# EAGLE design band-dsp-feather (EAGLE 8.2.1)
DATABASE: /Users/ingolia/Dropbox/Experiments/turbidostat/nephelometer/circuitry/partsdb.txt
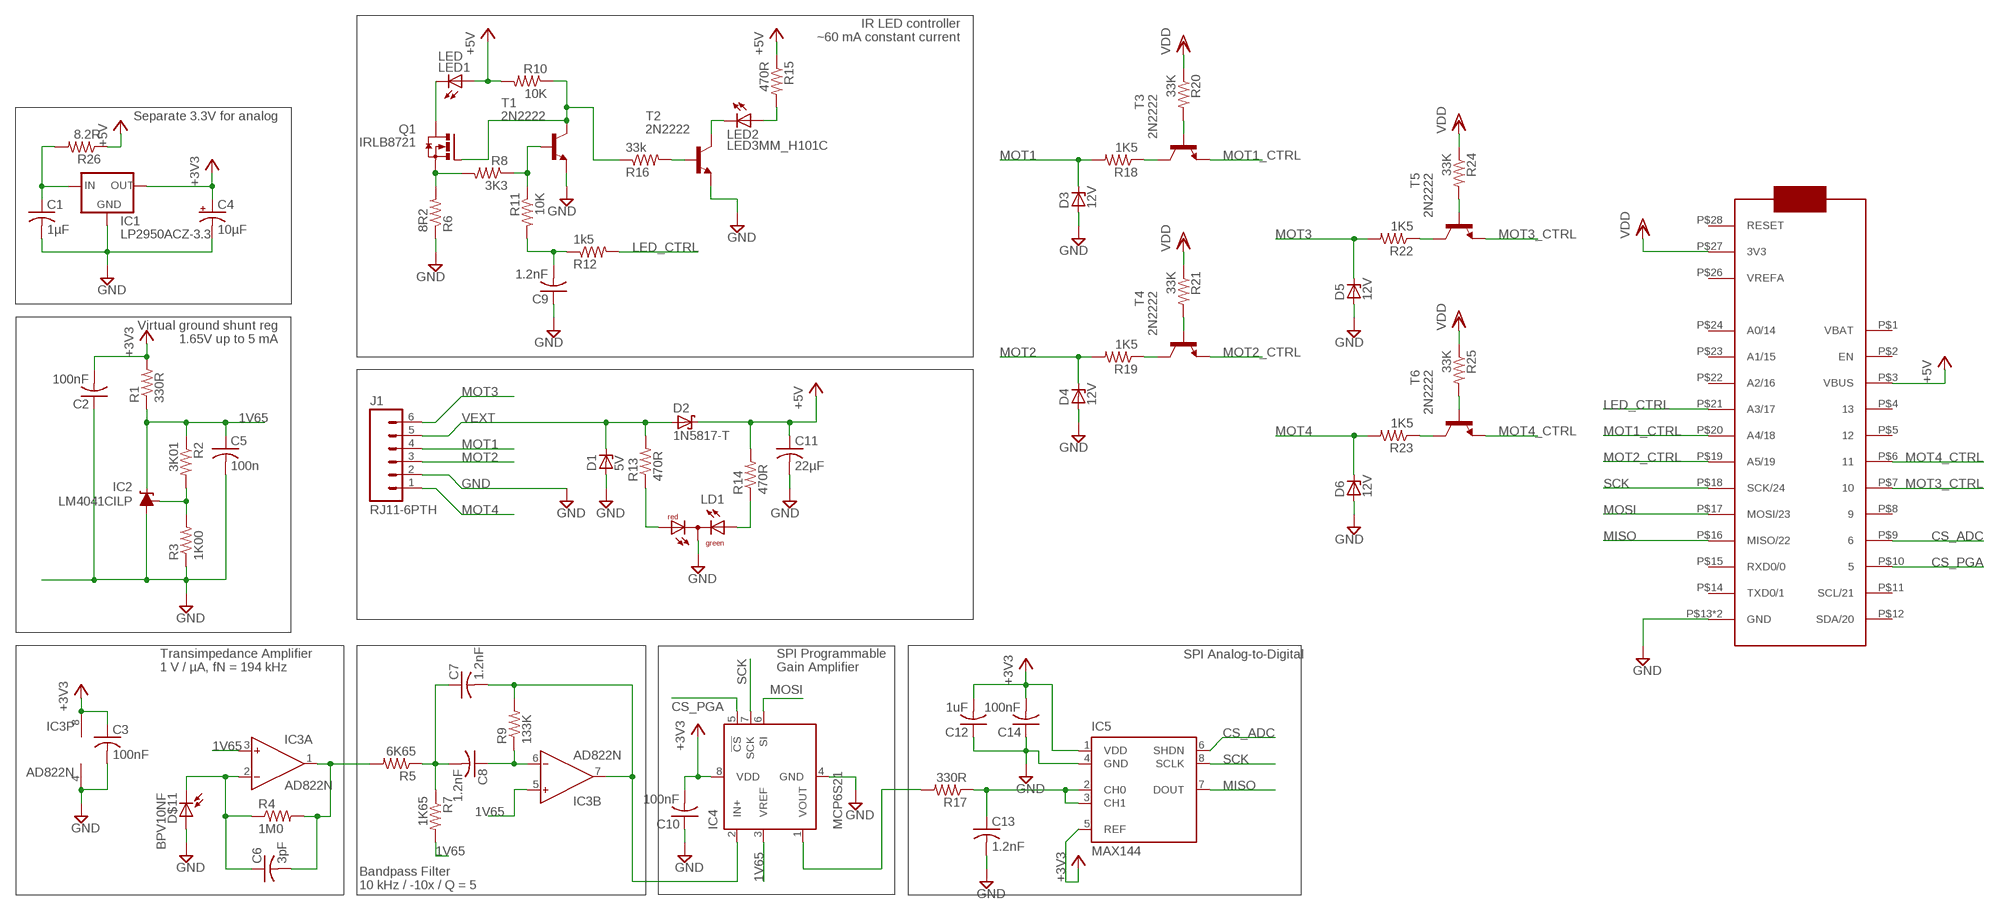
[diagram p0: schematic, sheet 1]

## Parts
C1  1µF  C-US025-030X050  [C025-030X050]
C2  100nF  C-US025-025X050  [C025-025X050]
C3  100nF  C-US025-025X050  [C025-025X050]
C4  10µF  CPOL-USE2.5-5  [E2,5-5]
C5  100n  C-US025-025X050  [C025-025X050]
C6  3pF  C-US025-024X044  [C025-024X044]
C7  1.2nF  C-US025-025X050  [C025-025X050]
C8  1.2nF  C-US025-025X050  [C025-025X050]
C9  1.2nF  C-US025-025X050  [C025-025X050]
C10  100nF  C-US025-025X050  [C025-025X050]
C11  22µF  C-US050-045X075  [C050-045X075]
C12  1uF  C-US025-025X050  [C025-025X050]
C13  1.2nF  C-US025-025X050  [C025-025X050]
C14  100nF  C-US025-025X050  [C025-025X050]
D1  5V  ZENER-DIODEF126-10  [F126Z10]
D2  1N5817-T  [DO41-7.6]
D3  12V  ZENER-DIODEF126-10  [F126Z10]
D4  12V  ZENER-DIODEF126-10  [F126Z10]
D5  12V  ZENER-DIODEF126-10  [F126Z10]
D6  12V  ZENER-DIODEF126-10  [F126Z10]
D$11  BPV10NF  [LED5MM]
IC1  LP2950ACZ-3.3  [TO92]
IC2  LM4041CILP  [LP_O-PBCY-W3]
IC3  AD822N  [DIL08]
IC4  MCP6S21  [DIL08]
IC5  MAX144  [DIL08]
IC6  FEATHER_M0  [FEATHER_M0]
J1  RJ11-6PTH  [RJ11-6]
LD1  DUOLED-RG-C  [DUOLED-C-5MM]
LED1  LED  1X02_3.5MM_LED  [1X02_3.5MM]
LED2  LED3MM_H101C  [LED3MM_H101C]
Q1  IRLB8721  [TO220BV]
R1  330R  R-US_0207/9  [0207/9]
R2  3K01  R-US_0207/9  [0207/9]
R3  1K00  R-US_0207/9  [0207/9]
R4  1M0  R-US_0207/9  [0207/9]
R5  6K65  R-US_0207/9  [0207/9]
R6  8R2  R-US_0207/9  [0207/9]
R7  1K65  R-US_0207/9  [0207/9]
R8  3K3  R-US_0207/9  [0207/9]
R9  133K  R-US_0207/9  [0207/9]
R10  10K  R-US_0207/9  [0207/9]
R11  10K  R-US_0207/9  [0207/9]
R12  1k5  R-US_0207/9  [0207/9]
R13  470R  R-US_0207/9  [0207/9]
R14  470R  R-US_0207/9  [0207/9]
R15  470R  R-US_0207/5V  [0207/5V]
R16  33k  R-US_0207/9  [0207/9]
R17  330R  R-US_0207/9  [0207/9]
R18  1K5  R-US_0207/9  [0207/9]
R19  1K5  R-US_0207/9  [0207/9]
R20  33K  R-US_0207/9  [0207/9]
R21  33K  R-US_0207/9  [0207/9]
R22  1K5  R-US_0207/9  [0207/9]
R23  1K5  R-US_0207/9  [0207/9]
R24  33K  R-US_0207/9  [0207/9]
R25  33K  R-US_0207/9  [0207/9]
R26  8.2R  R-US_0207/9  [0207/9]
T1  2N2222  [TO92-EBC-OVAL]
T2  2N2222  [TO92-EBC-OVAL]
T3  2N2222  [TO92-EBC-OVAL]
T4  2N2222  [TO92-EBC-OVAL]
T5  2N2222  [TO92-EBC-OVAL]
T6  2N2222  [TO92-EBC-OVAL]

## Nets
1V65: C5.1 IC2.2(C) IC3.3(A:IN+) IC3.5(B:IN+) IC4.3(VREF) R1.1 R2.1 R7.2
+3V3: C2.2 C3.1 C4.+ C10.2 C12.2 C14.2 IC1.1(OUT) IC3.8(P:V+) IC4.8(VDD) IC5.1(VDD) IC5.5(REF) R1.2
+5V: C11.1 D2.C IC6.P$3(VBUS) LED1.1A(A) R10.2 R14.2 R15.1 R26.1
BPF: C7.2 IC3.7(B:OUT) IC4.2(IN+) R9.2
CS_ADC: IC5.6(SHDN) IC6.P$9
CS_PGA: IC4.5(!CS) IC6.P$10
FB: C6.1 D$11.K IC3.2(A:IN-) R4.1
GND: C1.2 C2.1 C3.2 C4.- C5.2 C9.1 C10.1 C11.2 C12.1 C13.2 C14.1 D1.A D3.A D4.A D5.A D6.A D$11.A IC1.2(GND) IC2.3(A) IC3.4(P:V-) IC4.4(GND) IC5.4(GND) IC6.P$13(GND) IC6.P$25(GND) J1.2 LD1.C R3.1 R6.1 T1.E T2.E
LED_CTRL: IC6.P$21(A3/17) R12.2
MISO: IC5.7(DOUT) IC6.P$16(MISO/22)
MOSI: IC4.6(SI) IC6.P$17(MOSI/23)
MOT1: D3.C J1.4 R18.2
MOT1_CTRL: IC6.P$20(A4/18) T3.E
MOT2: D4.C J1.3 R19.2
MOT2_CTRL: IC6.P$19(A5/19) T4.E
MOT3: D5.C J1.6 R22.2
MOT3_CTRL: IC6.P$7 T5.E
MOT4: D6.C J1.1 R23.2
MOT4_CTRL: IC6.P$6 T6.E
N$1: R19.1 T4.C
N$2: R21.2 T4.B
N$3: C7.1 C8.2 R5.1 R7.1
N$4: IC4.1(VOUT) R17.2
N$5: R22.1 T5.C
N$6: R24.2 T5.B
N$7: LD1.AX(AG) R14.1
N$8: Q1.G R10.1 R16.1 T1.C
N$9: C8.1 IC3.6(B:IN-) R9.1
N$10: R23.1 T6.C
N$11: LED2.A R15.2
N$12: LED2.K T2.C
N$13: R8.1 R11.1 T1.B
N$14: Q1.S R6.2 R8.2
N$15: C9.2 R11.2 R12.1
N$16: R16.2 T2.B
N$18: LED1.2K(K) Q1.D
N$19: R18.1 T3.C
N$20: R20.2 T3.B
N$21: R25.2 T6.B
N$22: LD1.AR R13.1
N$23: C13.1 IC5.2(CH0) IC5.3(CH1) R17.1
N$24: C1.1 IC1.3(IN) R26.2
N$35: IC2.1(FB) R2.2 R3.2
SCK: IC4.7(SCK) IC5.8(SCLK) IC6.P$18(SCK/24)
TIA: C6.2 IC3.1(A:OUT) R4.2 R5.2
VDD: IC6.P$27(3V3) R20.1 R21.1 R24.1 R25.1
VEXT: D1.C D2.A J1.5 R13.2
Unconnected: IC6.P$1(VBAT) IC6.P$2(EN) IC6.P$4 IC6.P$5 IC6.P$8 IC6.P$11(SCL/21) IC6.P$12(SDA/20) IC6.P$14(TXD0/1) IC6.P$15(RXD0/0) IC6.P$22(A2/16) IC6.P$23(A1/15) IC6.P$24(A0/14) IC6.P$26(VREFA) IC6.P$28(RESET)

## Notes on the sheet
- IR LED controller
  ~60 mA constant current
- Separate 3.3V for analog
- Virtual ground shunt reg
  1.65V up to 5 mA
- SPI Analog-to-Digital
- Transimpedance Amplifier
  1 V / µA, fN = 194 kHz
- SPI Programmable
  Gain Amplifier
- Bandpass Filter
  10 kHz / -10x / Q = 5

## Library data of the parts
C1 C12 = adafruit:C-US: CAPACITOR, American symbol; DIGIKEY#: 445-5318-ND; MANF: TDK Corporation; MANF#: FK14X7R1C105K
C2 C3 C5 C10 C14 = adafruit:C-US: CAPACITOR, American symbol; DIGIKEY#: BC1084CT-ND; MANF: Vishay BC Components; MANF#: K104K15X7RF5TL2
C4 = adafruit:CPOL-US: POLARIZED CAPACITOR, American symbol; DIGIKEY#: 478-8042-1-ND; MANF: AVX Corporation; MANF#: TAP106K016SRW
C6 = adafruit:C-US: CAPACITOR, American symbol; DIGIKEY#: 445-8377-ND; MANF: TDK Corporation; MANF#: FK18C0G1H030C
C7-C9 C13 = adafruit:C-US: CAPACITOR, American symbol; DIGIKEY#: BC1026CT-ND; MANF: Vishay BC Components; MANF#: K122J15C0GF5TL2
C11 = adafruit:C-US: CAPACITOR, American symbol; DIGIKEY#: 445-8455-ND; MANF: TDK Corporation; MANF#: FK20X7R1C226M
D1 = diode:ZENER-DIODE: Z-Diode; DIGIKEY#: SA5.0ALFCT-ND; MANF: Littelfuse Inc.; MANF#: SA5.0A
D2 = diode:1N581*: 1.0A SCHOTTKY BARRIER RECTIFIER Source: http://www.diodes.com/datasheets/ds23001.pdf; DIGIKEY#: 1N5817FSCT-ND; MANF: Fairchild Semiconductor; MANF#: 1N5817
D3-D6 = diode:ZENER-DIODE: Z-Diode; DIGIKEY#: SA12ALFCT-ND; MANF: Littelfuse Inc.; MANF#: SA12A
D$11 = ingolia:BPV10NF; DIGIKEY#: 751-1002-ND; MANF: Vishay Semiconductor Opto Division; MANF#: BPV10NF
IC1 = v-reg:LP2950?*: Source: http://cache.national.com/ds/LP/LP2950.pdf; DIGIKEY#: LP2950ACZ-3.3/NOPB-ND; MANF: Texas Instruments; MANF#: LP2950ACZ-3.3/NOPB
IC2 = texas:LM4041*I: PRECISION MICROPOWER SHUNT VOLTAGE REFERENCE Adjustable Output Source: http://focus.ti.com/lit/ds/slcs146e/slcs146e.pdf; DIGIKEY#: 296-22173-1-ND; MANF: Texas Instruments; MANF#: LM4041CILPR; MPN: LM4041CILP; OC_FARNELL: 1673945; OC_NEWARK: 50M8856
IC3 = analog-devices:AD822: Single-Supply, Rail-to-Rail Low Power FET-Input Op Amp Source: http://www.analog.com/static/imported-files/data_sheets/AD822.pdf; DIGIKEY#: AD823ANZ-ND; MANF: Analog Devices Inc.; MANF#: AD823ANZ; OC_FARNELL: 1438581; OC_NEWARK: unknown
IC4 = ingolia:MCP6S21; DIGIKEY#: MCP6S91-E/P-ND; MANF: Microchip Technology; MANF#: MCP6S91-E/P
IC5 = ingolia:MAX144; DIGIKEY#: MAX144ACPA+-ND; MANF: Maxim Integrated; MANF#: MAX144ACPA+
IC6 = ingolia:FEATHER_M0; DIGIKEY#: 1528-1531-ND; DIGIKEY2#: 2830-ND; MANF: Adafruit Industries LLC; MANF#: 2772; MANF2: Adafruit Industries LLC; MANF2#: 2830
J1 = SparkFun-Connectors:RJ11-6: RJ11 Jack Simple 6 pin RJ11 jack. Commonly found on CAT3 devices and Microchip programmers. SKU: PRT-00132; DIGIKEY#: AE10383-ND; MANF: Assmann WSW Components; MANF#: A-2004-1-4-LP-N-R
LD1 = led:DUOLED-RG-C: DUO LED 2 colors (red/green), 5 mm, round, common Cathode www.ligitek.com or other producers.; DIGIKEY#: 754-1221-ND; MANF: Kingbright; MANF#: WP3VEGW
LED1 = ingolia:1X02_3.5MM_LED; DIGIKEY#: 475-3002-ND; DIGIKEY2#: 492-1502-ND; DIGIKEY3#: ED2740-ND; MANF: OSRAM Opto Semiconductors Inc; MANF#: SFH 4547; MANF2: Bivar Inc; MANF2#: CR-174; MANF3: On Shore Technology Inc.; MANF3#: OSTTE020104
LED2 = ingolia:LED3MM_H101C; DIGIKEY#: 754-1727-ND; DIGIKEY2#: 492-1789-ND; MANF: Kingbright; MANF#: WP710A10SYD; MANF2: Bivar Inc.; MANF2#: H-101C
Q1 = ingolia:IRLB8721; DIGIKEY#: IRLB8721PBF-ND; MANF: Infineon Technologies; MANF#: IRLB8721PBF
R1 = adafruit:R-US_: RESISTOR, American symbol; DIGIKEY#: CF14JT330RCT-ND; MANF: Stackpole Electronics Inc.; MANF#: CF14JT330R
R2 = adafruit:R-US_: RESISTOR, American symbol; DIGIKEY#: RNF14FTD3K01CT-ND; MANF: Stackpole Electronics Inc.; MANF#: RNF14FTD3K01
R3 = adafruit:R-US_: RESISTOR, American symbol; DIGIKEY#: RNF14FTD1K00CT-ND; MANF: Stackpole Electronics Inc.; MANF#: RNF14FTD1K00
R4 = adafruit:R-US_: RESISTOR, American symbol; DIGIKEY#: RNV14FAL1M00CT-ND; MANF: Stackpole Electronics Inc; MANF#: RNV14FAL1M00
R5 = adafruit:R-US_: RESISTOR, American symbol; DIGIKEY#: 6.65KXBK-ND; MANF: Yageo; MANF#: MFR-25FBF52-6K65
R6 R26 = adafruit:R-US_: RESISTOR, American symbol; DIGIKEY#: S8.2HCT-ND; MANF: Stackpole Electronics Inc.; MANF#: CFM12JT8R20
R7 = adafruit:R-US_: RESISTOR, American symbol; DIGIKEY#: 1.65KXBK-ND; MANF: Yageo; MANF#: MFR-25FBF52-1K65
R8 = adafruit:R-US_: RESISTOR, American symbol; DIGIKEY#: CF14JT3K30CT-ND; MANF: Stackpole Electronics Inc; MANF#: CF14JT3K30
R9 = adafruit:R-US_: RESISTOR, American symbol; DIGIKEY#: 133KXBK-ND; MANF: Yageo; MANF#: MFR-25FBF52-133K
R10 R11 = adafruit:R-US_: RESISTOR, American symbol; DIGIKEY#: CF14JT10K0CT-ND; MANF: Stackpole Electronics Inc; MANF#: CF14JT10K0
R12 = adafruit:R-US_: RESISTOR, American symbol; DIGIKEY#: CF14JT1K50CT-ND; MANF: Stackpole Electronics Inc; MANF#: CF14JT1K50
R13-R15 = adafruit:R-US_: RESISTOR, American symbol; DIGIKEY#: CF14JT470RCT-ND; MANF: Stackpole Electronics Inc.; MANF#: CF14JT470R
R16 = adafruit:R-US_: RESISTOR, American symbol; DIGIKEY#: CF14JT33K0CT-ND; MANF: Stackpole Electronics Inc; MANF#: CF14JT33K0
R17 = adafruit:R-US_: RESISTOR, American symbol; DIGIKEY#: S330CACT-ND; MANF: Stackpole Electronics Inc.; MANF#: RNMF14FTC330R
R18 R19 R22 R23 = adafruit:R-US_: RESISTOR, American symbol; DIGIKEY#: CF14JT1K50CT-ND; MANF: Stackpole Electronics Inc.; MANF#: CF14JT1K50
R20 R21 R24 R25 = adafruit:R-US_: RESISTOR, American symbol; DIGIKEY#: CF14JT33K0CT-ND; MANF: Stackpole Electronics Inc.; MANF#: CF14JT33K0
T1-T6 = adafruit:2N2222: NPN TRANSISTOR Big oval pads; DIGIKEY#: PN2222ATFCT-ND; MANF: Fairchild Semiconductor; MANF#: PN2222ATF

## Board
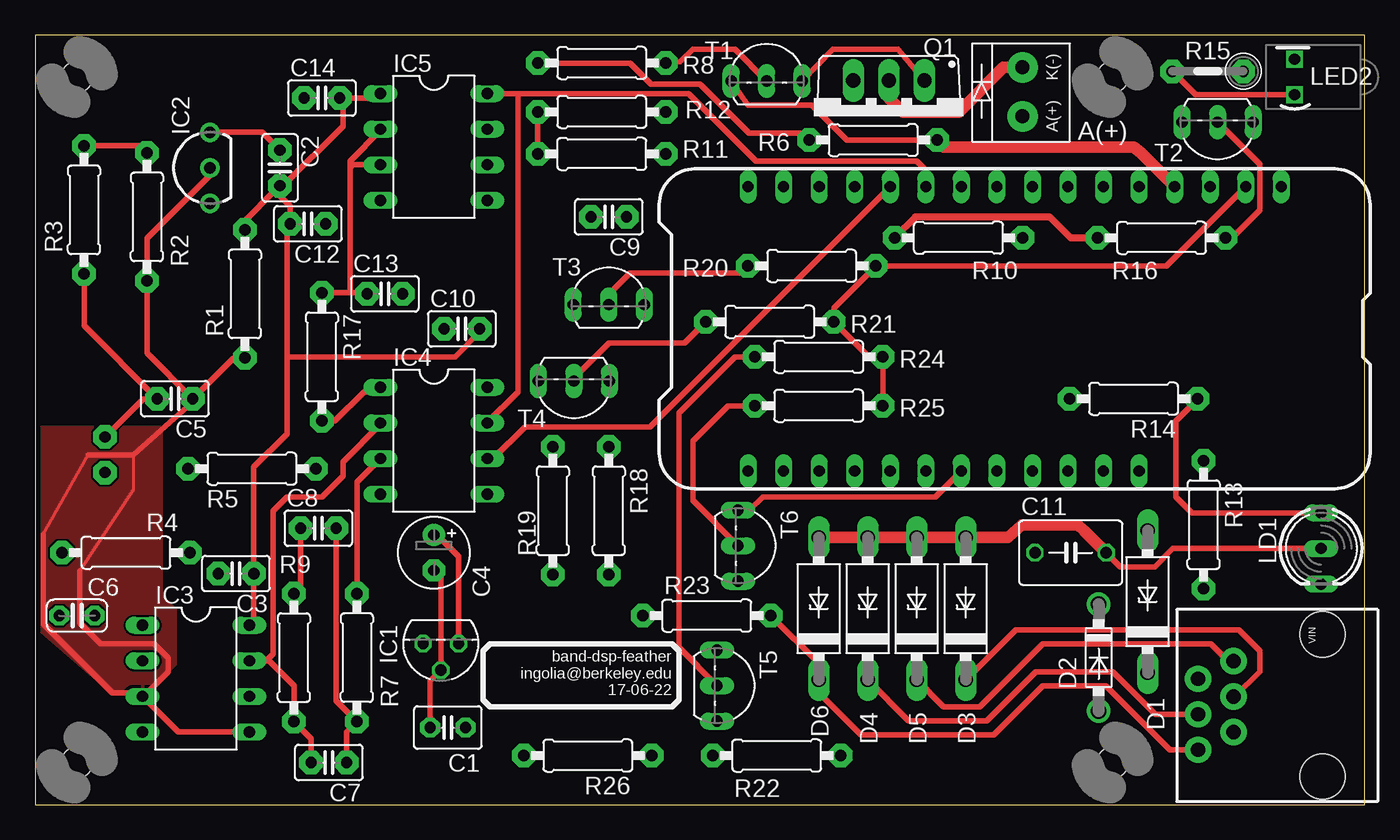
[diagram p1: board, top side]
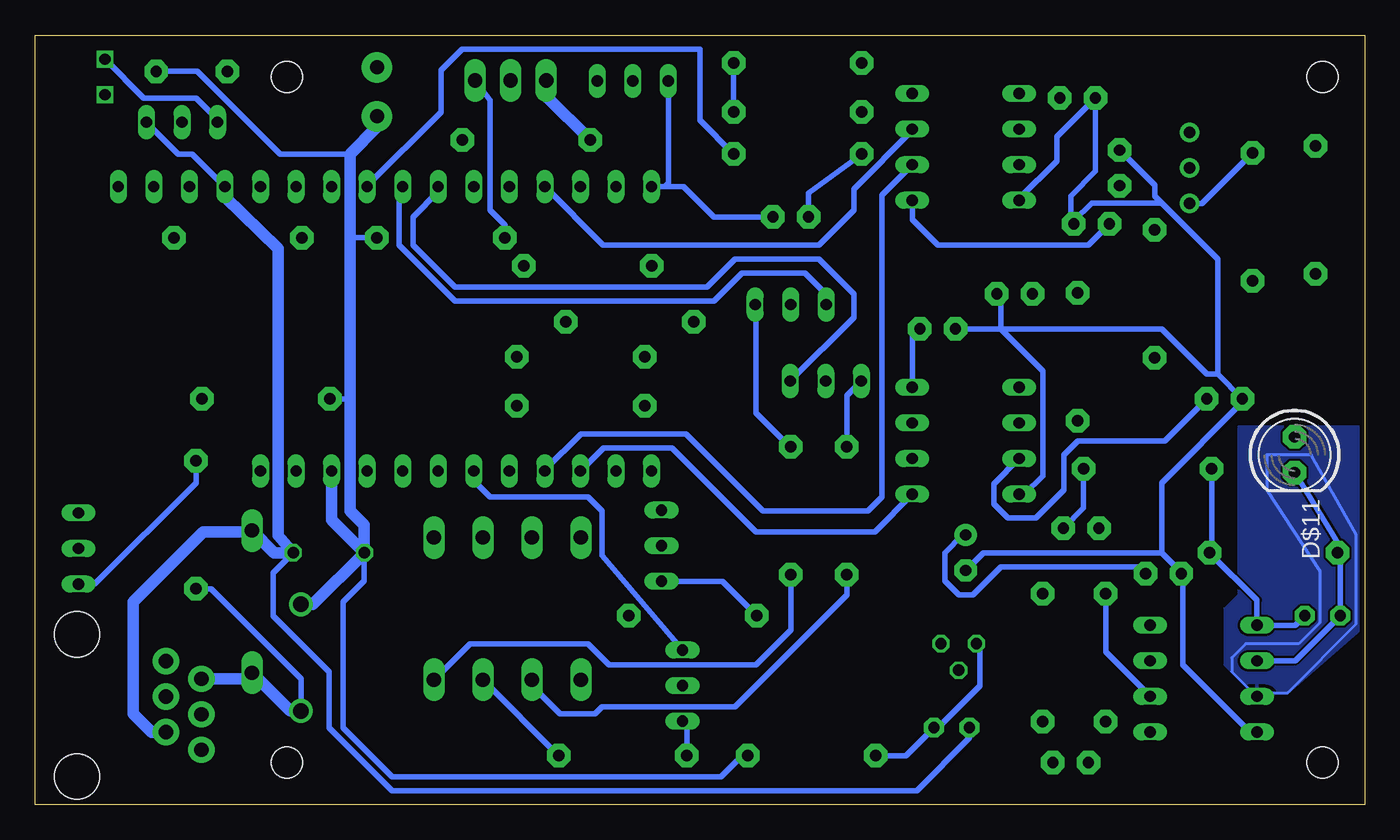
[diagram p2: board, bottom side, seen from below]

Size 95 x 55 mm. Coordinates in mm from the lower left corner, seen from the top.
Outline: 0,0 95,0 95,55 0,55 0,0
Copper layers (1*16): Top 0.0356mm / dielectric 1.5011mm / Bottom 0.0356mm
Design rules "oshpark-2layer": minimum track width 6mil, minimum drill 13mil, track to track 6mil, track to pad 6mil, pad to pad 6mil, via to via 6mil, smd to smd 6mil, copper to edge 15mil, drill to drill 6mil, minimum pad ring 7mil, minimum via ring 7mil, stop-mask expansion 2.5mil, vias tented up to drill 0mil, thermal gap 10mil

### Footprints (pad centres in the part's own frame; a part is rotated, then mirrored left to right if it is on the bottom)
C025-030X050 = drill 0.813 pad 1.422 octagon: 1 -1.27,0; 2 1.27,0
C025-025X050 = drill 0.813 pad 1.676 octagon: 1 -1.27,0; 2 1.27,0
E2,5-5 = drill 0.813 pad 1.6: + -1.27,0 | drill 0.813 pad 1.6 octagon: - 1.27,0
C025-024X044 = drill 0.813 pad 1.422 octagon: 1 -1.27,0; 2 1.27,0
C050-045X075 = drill 0.813 octagon: 1 -2.54,0; 2 2.54,0
F126Z10 = drill 1.016 long: A 5.08,0; C -5.08,0
DO41-7.6 = drill 1.1 pad 1.7: A 3.81,0; C -3.81,0
LED5MM = drill 0.813 pad 1.676 octagon: A -1.27,0; K 1.27,0
TO92 = drill 0.813 octagon: 1 -1.27,0; 2 0,1.905; 3 1.27,0
LP_O-PBCY-W3 = drill 0.8 pad 1.4: 1 -2.54,0; 2 0,0; 3 2.54,0
DIL08 = drill 0.813 long: 1 -3.81,-3.81; 2 -1.27,-3.81; 3 1.27,-3.81; 4 3.81,-3.81; 5 3.81,3.81; 6 1.27,3.81; 7 -1.27,3.81; 8 -3.81,3.81
FEATHER_M0 = drill 0.8 long: P$1 -8.89,10.16; P$2 -6.35,10.16; P$3 -3.81,10.16; P$4 -1.27,10.16; P$5 1.27,10.16; P$6 3.81,10.16; P$7 6.35,10.16; P$8 8.89,10.16; P$9 11.43,10.16; P$10 13.97,10.16; P$11 16.51,10.16; P$12 19.05,10.16; P$13 19.05,-10.16; P$14 16.51,-10.16; P$15 13.97,-10.16; P$16 11.43,-10.16; P$17 8.89,-10.16; P$18 6.35,-10.16; P$19 3.81,-10.16; P$20 1.27,-10.16; P$21 -1.27,-10.16; P$22 -3.81,-10.16; P$23 -6.35,-10.16; P$24 -8.89,-10.16; P$25 -11.43,-10.16; P$26 -13.97,-10.16; P$27 -16.51,-10.16; P$28 -19.05,-10.16
RJ11-6 = drill 1.016 pad 1.88: 1 1.905,8.89; 2 3.175,6.35; 3 4.445,8.89; 4 5.715,6.35; 5 6.985,8.89; 6 8.255,6.35 | hole 3.251: 0,0; 10.16,0
DUOLED-C-5MM = drill 0.813 long: AR 2.54,0; AX -2.54,0; C 0,0
1X02_3.5MM = drill 1 pad 2.184: 1A 1.8,0; 2K -1.7,0
LED3MM_H101C = drill 0.8 square: A 1.27,0; K -1.27,0
TO220BV = drill 1.016 long: D 0,0; G -2.54,0; S 2.54,0
0207/9 = drill 0.813 pad 1.676 octagon: 1 -4.572,0; 2 4.572,0
0207/5V = drill 0.813 pad 1.676 octagon: 1 -2.54,0; 2 2.54,0
TO92-EBC-OVAL = drill 0.813 long: B 0,-1.27; C 2.54,-1.27; E -2.54,-1.27
M2MOUNT = hole 2.2: 0,0

### Placement (x,y rotation side)
C1  29.5,5.5 180 top
C2  17.5,45.5 270 top
C3  14.36,16.51 180 top
C4  28.5,18 270 top
C5  10,29 180 top
C6  3,13.5 0 top
C7  21,3 180 top
C8  20.25,19.75 0 top
C9  41,42 180 top
C10  30.5,34 0 top
C11  74,18 0 top
C12  19.5,41.5 180 top
C13  25,36.5 0 top
C14  20.5,50.5 0 top
D1  79.5,14.5 90 top
D2  76,10.5 270 top
D3  66.5,14 90 top
D4  59.5,14 90 top
D5  63,14 90 top
D6  56,14 90 top
D$11  5,25 270 bottom
IC1  29,11.5 180 top
IC2  12.5,45.5 90 top
IC3  11.5,9 270 top
IC4  28.5,26 270 top
IC5  28.5,47 270 top
IC6  70,34 180 top
J1  92,2 90 top
LD1  91.9,18.3 270 top
LED1  70.56,50.98 270 top
LED2  90,52 270 top
Q1  61.01,51.75 180 top
R1  15,36.5 90 top
R2  8,42 90 top
R3  3.5,42.5 90 top
R4  6.5,18 0 top
R5  15.5,24 180 top
R6  59.89,47.49 180 top
R7  23,10.5 90 top
R8  40.5,53 180 top
R9  18.5,10.5 270 top
R10  65.99,40.51 0 top
R11  40.5,49.5 180 top
R12  40.5,46.5 0 top
R13  83.5,20 270 top
R14  78.5,29 180 top
R15  83.8,52.4 180 top
R16  80.5,40.5 0 top
R17  20.5,32 270 top
R18  41,21 270 top
R19  37,21 270 top
R20  55.5,38.5 180 top
R21  52.5,34.5 180 top
R22  53,3.5 0 top
R23  48,13.5 0 top
R24  56,32 180 top
R25  56,28.5 180 top
R26  39.5,3.5 180 top
T1  52.28,52.98 0 top
T2  84.5,47.5 180 top
T3  41,37 0 top
T4  38.5,29 180 top
T5  50,8.5 270 top
T6  51.5,18.5 270 top
U$1  [M2MOUNT]  3,3 0 top
U$2  [M2MOUNT]  77,52 0 top
U$3  [M2MOUNT]  77,3 0 top
U$4  [M2MOUNT]  3,52 0 top

### Tracks (layer width: path | path; a pad name or v marks a point on that pad's centre or on a via)
1V65
  Top 0.203: 0.6,19.3 3.8,25 | 7,25 7,22.5 3.2,16.7
  Top 0.406: 3.8,25 7,25 11.27,28.77 C5.1 | 3.2,16.7 3.2,13 4.7,11.5 8.5,11.5 9.5,10.5 9.5,9.5 8,8 5.5,8 0.6,12.9 0.6,19.3 | IC3.5 10.23,5.19 IC3.3 | R7.2 23,23.04 IC4.3 | IC2.2 12.5,45 8,40.5 R2.1 8,32.27 C5.1 | R1.1 14.2,31.93 C5.1
  Bottom 0.203: 7,25 7,22.5 3.2,16.7 3.2,13 4.7,11.5 8.5,11.5 9.5,10.5 9.5,9.5 8,8 5.5,8 0.6,12.9 0.6,19.3 3.8,25 7,25
  Bottom 0.406: IC4.3 26.5,22.92 26.5,21.5 25.5,20.5 23.5,20.5 21.5,22.5 21.5,25 20.5,26 14.27,26 C5.1
  pour Top: 0.2,12.6 0.3,27 9,27 9,15 10,14 10,10 8,8 5.5,8
  pour Bottom: 0.2,12.6 0.3,27 9,27 9,15 10,14 10,10 8,8 5.5,8
+3V3
  Top 0.406: R1.2 15,41.73 17.14,43.87 | 17.14,43.87 C2.2 | 17.73,44 C2.2 | IC5.1 24.38,50.5 C14.2 22,50.27 22,48.5 17.73,44.23 C2.2 | IC3.8 15.63,13.13 C3.1 15.63,24.13 18,26.5 18,32 | IC1.1 30.27,17.73 29,19 28.77,19 C4.+ | 17.14,43.87 18.23,42.77 C12.2 18,41.27 18,32 | C10.2 31.77,33.77 30,32 18,32
  Bottom 0.406: IC4.8 32.31,33.46 C10.2 | C4.+ 28.73,19.27 30,18 30,16 29,15 28,15 26,17 16.12,17 C3.1 | IC5.5 32.31,41.81 30.5,40 19.73,40 C12.2
+5V
  Bottom 0.406: C11.1 71.5,17.96 71.5,16 73,14.5 73,5.5 69.5,2 46,2 44.5,3.5 R26.1 | R10.2 72.49,40.51 72.5,40.5 | R14.2 72.5,29 | R15.1 83.4,52.4 77.5,46.5 72.5,46.5
  Bottom 0.813: LED1.1A 70.56,48.44 72.5,46.5 72.5,40.5 72.5,29 72.5,21 71.5,20 71.5,18.04 C11.1 | D2.C 75.15,14.31 C11.1 | IC6.P$3 73.81,20.35 C11.1
BPF
  Top 0.406: IC3.7 16.5,10.27 | 16.5,10.27 16.73,10.27 18.5,8.5 R9.2 19.73,4.7 C7.2 | IC4.2 24.69,27.19 22,24.5 22,23.5 20.5,22 18,22 17,21 17,10.77 16.5,10.27
CS_ADC
  Bottom 0.406: IC6.P$9 58.57,23.93 56,26.5 48.5,26.5 43,21 35.5,21 34.5,22 34.5,43.54 IC5.6
CS_PGA
  Bottom 0.406: IC4.5 35,19.5 43.5,19.5 49.5,25.5 54.37,25.5 IC6.P$10
FB
  Bottom 0.406: D$11.K 1.86,18.59 1.86,18.07 R4.1 1.73,17.94 C6.1 4.96,10.27 IC3.2
GND
  Top 0.406: D$11.A 7.73,29 C5.2 3.5,34.23 R3.1 | IC2.3 16.23,48.04 C2.1 | C4.- 29,16.23 IC1.2 28.23,8.82 C1.2 | LD1.C 81.3,18.3 80,17 77.54,17 C11.2 | R6.1 58.01,47.49 55.5,50 50.95,50 T1.E
  Top 0.813: R6.1 64.95,47 78.5,47 79,46.59 IC6.P$25 | D6.A D4.A D5.A D3.A 69.5,19.08 70.5,20 74.5,20 74.96,19.58 C11.2
  Bottom 0.406: T2.E 84.77,46.5 83.77,46.5 IC6.P$25 | IC3.4 8.19,5.19 13,10 13,16.42 C3.2 13.09,16.59 14.5,18 | 28.28,16.51 C4.- 27.23,18 14.5,18 | 14.5,18 14.5,23 8.73,28.77 C5.2 10.5,30.77 | IC5.4 24.69,43.31 22,46 22,47.73 C14.1 19.23,45.27 21,43.5 21,41.73 C12.1 20.77,41.73 19.5,43 14.5,43 | 14.5,43 10.5,39 10.5,30.77 | 14.5,43 15,43.5 15,44.27 C2.1 | IC4.4 24.31,22.19 23,23.5 23,31 26,34 | 26,34 26,36.23 C13.2 | 26,34 C10.1 | 10.5,30.77 11.27,30.77 14.5,34 26,34 | C1.2 28.23,4.77 32,1 69.5,1 74,5.5 74,9.5 78,13.5 78,16.54 C11.2 | C9.1 46.5,42 48.66,44.16 50,44.16 | 50,44.16 IC6.P$13 | T1.E 49.74,44.42 50,44.16
  Bottom 0.813: J1.2 86.67,5.18 88,6.5 88,14.5 83,19.5 79.58,19.5 D1.A 77.92,18 C11.2 77.62,19.25 77.62,39.75 81.43,43.43 IC6.P$25
LED_CTRL
  Bottom 0.406: IC6.P$21 71.27,44.23 66,49.5 66,52.5 64.5,54 47.5,54 47.5,48.93 R12.2
MISO
  Bottom 0.406: IC5.7 32.31,48.19 36.5,44 36.5,42.5 39,40 54.41,40 IC6.P$16
MOSI
  Top 0.406: IC4.6 32.73,24.73 35,27 43.95,27 IC6.P$17
MOT1
  Top 0.406: J1.4 85.72,7.71 87.5,9.5 87.5,11 86,12.5 70.08,12.5 D3.C
  Bottom 0.406: R18.2 41,12.5 43.5,10 54,10 55.5,11.5 63.92,11.5 D3.C
MOT1_CTRL
  Bottom 0.406: T3.E 38.46,36.46 40,38 44.5,38 46.5,36 65,36 69,40 69,43.89 IC6.P$20
MOT2
  Top 0.406: J1.3 80.06,6.45 77,9.5 71.5,9.5 68,6 62.42,6 D4.C
  Bottom 0.406: R19.2 37,15 45,7 54.5,7 55,6.5 57.5,6.5 59.5,8.5 D4.C
MOT2_CTRL
  Bottom 0.406: IC6.P$19 66.19,43.81 68,42 68,40 65,37 47,37 45,39 39,39 36.5,36.5 36.5,34.81 T4.E
MOT3
  Top 0.406: J1.6 85.25,10.26 84,11.5 72,11.5 67.5,7 64.92,7 D5.C
  Bottom 0.406: R22.2 D5.C
MOT3_CTRL
  Bottom 0.406: IC6.P$7 63.65,23.15 62.5,22 55.5,22 54.5,21 54.5,17.81 T5.E
MOT4
  Top 0.406: J1.1 81.09,3.9 76.5,8.5 72,8.5 68.5,5 59,5 56,8 D6.C 56,10.07 R23.2
MOT4_CTRL
  Top 0.406: T6.E 51.04,21.04 52,22 64.35,22 IC6.P$6
N$1
  Bottom 0.406: R19.1 37,29.23 T4.C
N$2
  Top 0.406: T4.B 38.5,30.5 41,33 46.43,33 R21.2
N$3
  Top 0.406: C7.1 22.27,5.2 R7.1 21.52,7.41 C8.2
  Bottom 0.406: R5.1 20.07,21.2 C8.2
N$4
  Top 0.406: R17.2 21.43,27.43 23.5,29.5 24.38,29.5 IC4.1
N$5
  Bottom 0.406: R22.1 48.43,5.66 T5.C
N$6
  Top 0.406: R24.2 50,32 46,28 46,11.23 T5.B
N$7
  Top 0.406: LD1.AX 82.66,20.84 81.5,22 81.5,27.43 R14.1
N$8
  Top 0.406: Q1.G 61.66,54 57,54 54.79,51.71 T1.C
  Top 0.508: R16.1 74,40.5 72.5,42 62.91,42 R10.1
  Bottom 0.406: R10.1 61.42,41.42 62.5,42.5 62.5,50.35 Q1.G
N$9
  Top 0.406: C8.1 18.98,15.55 R9.1
  Bottom 0.406: IC3.6 18.5,10.92 R9.1
N$10
  Bottom 0.406: T6.C 45.89,15.96 R23.1
N$11
  Top 0.406: LED2.A 82.93,50.73 R15.2
N$12
  Bottom 0.406: T2.C 81.96,48.96 83.5,50.5 87.23,50.5 LED2.K
N$13
  Top 0.406: R8.1 46.07,53.07 47,54 50,54 T1.B
  Bottom 0.406: R11.1 R8.1
N$14
  Top 0.406: R8.2 42.5,53 44,51.5 47.5,51.5 51,48 54.81,48 R6.2
  Bottom 0.813: Q1.S 58.47,50.64 R6.2
N$15
  Top 0.406: R11.2 R12.1
  Bottom 0.406: C9.2 39.73,43.7 R12.1
N$16
  Top 0.406: R16.2 85.5,40.5 87.5,42.5 87.5,45.77 T2.B
N$18
  Top 0.813: LED1.2K 69.18,52.68 66,49.5 62,49.5 61.01,50.49 Q1.D
N$19
  Bottom 0.406: R18.1 41.07,25.57 43.5,28 43.5,35.69 T3.C
N$20
  Top 0.406: T3.B 41,36.5 42.5,38 50.43,38 R20.2
N$21
  Top 0.406: R25.2 49.5,28.5 47,26 47,21.73 T6.B
N$22
  Bottom 0.406: LD1.AR 90.74,15.76 83.5,23 R13.1
N$23
  Top 0.406: R17.1 22.5,36.57 | 22.5,36.57 23.66,36.57 C13.1 | IC5.2 24.69,48.19 22.5,46 22.5,45.5 | 22.5,45.5 22.5,36.57 | IC5.3 22.73,45.73 22.5,45.5
N$24
  Bottom 0.406: IC1.3 27.5,11.27 27.5,8.5 30.5,5.5 C1.1 32.77,3.5 R26.2
N$35
  Top 0.406: R3.2 7.5,47.07 R2.2
  Bottom 0.406: IC2.1 11.61,42.96 R2.2
SCK
  Top 0.406: IC4.7 32.31,27.31 34.5,29.5 34.5,50.8 | 34.5,50.8 34.5,50.82 IC5.8 | IC6.P$18 63.65,45.35 63,46 51.5,46 46.7,50.8 34.5,50.8
  Bottom 0.406: IC6.P$18
TIA
  Bottom 0.406: C6.2 4.96,12.81 IC3.1 7.69,14.62 R4.2 | R4.2 | R5.2 10.93,18.14 R4.2
VDD
  Top 0.406: R25.1 R24.1 59.57,32 R21.1 57.07,35.5 R20.1 80.85,38.5 IC6.P$27
VEXT
  Bottom 0.406: R13.2 82.43,15.43 76,9 D2.A
  Bottom 0.813: D2.A 76.77,6.69 D1.C 79.94,8.98 J1.5

### Text on the board
tPlace: A(+) | band-dsp-feather / ingolia@berkeley.edu / 17-06-22 | VIN